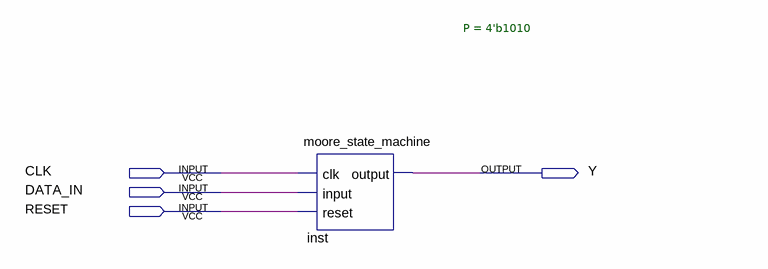
[diagram p0: schematic sheet]
// Quartus schematic behavioural.bdf as structural Verilog: 1 symbols, 4 pins
module behavioural (
  input  CLK,
  input  DATA_IN,
  input  RESET,
  output Y
);

  moore_state_machine #(.P(4'b1010)) inst (.clk(CLK), .\input (DATA_IN), .reset(RESET), .\output (Y));
endmodule
